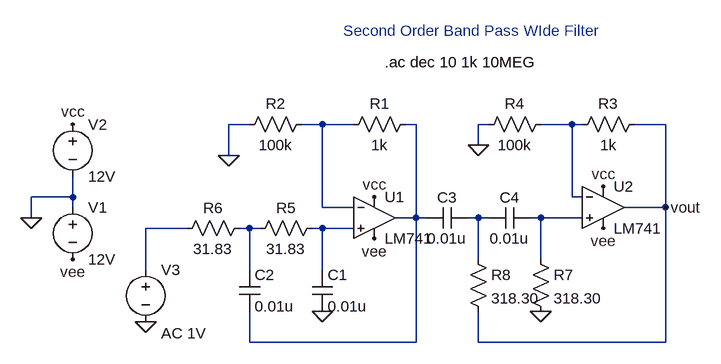
[diagram p0: schematic second_order_band_pass_wide.asc]
second_order_band_pass_wide.asc, the LTspice schematic file:
Version 4.1
SHEET 1 880 680
WIRE 144 32 112 32
WIRE 256 32 224 32
WIRE 304 32 256 32
WIRE 400 32 384 32
WIRE 512 32 496 32
WIRE 640 32 592 32
WIRE 656 32 640 32
WIRE 784 32 736 32
WIRE 496 64 496 32
WIRE 112 80 112 32
WIRE -128 144 -128 112
WIRE -128 144 -192 144
WIRE 640 144 640 32
WIRE 656 144 640 144
WIRE -128 160 -128 144
WIRE 256 160 256 32
WIRE 304 160 256 160
WIRE 784 160 784 32
WIRE 784 160 720 160
WIRE -192 176 -192 144
WIRE 400 176 400 32
WIRE 400 176 368 176
WIRE 416 176 400 176
WIRE 496 176 480 176
WIRE 512 176 496 176
WIRE 592 176 576 176
WIRE 656 176 592 176
WIRE 48 192 -16 192
WIRE 144 192 128 192
WIRE 160 192 144 192
WIRE 256 192 240 192
WIRE 304 192 256 192
WIRE 496 240 496 176
WIRE 592 240 592 176
WIRE -16 256 -16 192
WIRE 144 256 144 192
WIRE 256 256 256 192
WIRE 144 368 144 320
WIRE 400 368 400 176
WIRE 400 368 144 368
WIRE 496 368 496 320
WIRE 784 368 784 160
WIRE 784 368 496 368
FLAG -192 176 0
FLAG 336 144 vcc
FLAG -128 32 vcc
FLAG 688 128 vcc
FLAG 336 208 vee
FLAG 688 192 vee
FLAG -128 240 vee
FLAG 496 64 0
FLAG 112 80 0
FLAG 256 320 0
FLAG 592 320 0
FLAG -16 336 0
FLAG 784 160 vout
SYMBOL voltage -128 144 R0
WINDOW 123 0 0 Left 0
WINDOW 39 0 0 Left 0
SYMATTR InstName V1
SYMATTR Value 12V
SYMBOL voltage -128 16 R0
WINDOW 123 0 0 Left 0
WINDOW 39 0 0 Left 0
SYMATTR InstName V2
SYMATTR Value 12V
SYMBOL LM741 336 112 R0
SYMATTR InstName U1
SYMBOL LM741 688 96 R0
SYMATTR InstName U2
SYMBOL res 400 16 R90
WINDOW 0 0 56 VBottom 2
WINDOW 3 32 56 VTop 2
SYMATTR InstName R1
SYMATTR Value 1k
SYMBOL res 240 16 R90
WINDOW 0 0 56 VBottom 2
WINDOW 3 32 56 VTop 2
SYMATTR InstName R2
SYMATTR Value 100k
SYMBOL res 752 16 R90
WINDOW 0 0 56 VBottom 2
WINDOW 3 32 56 VTop 2
SYMATTR InstName R3
SYMATTR Value 1k
SYMBOL res 608 16 R90
WINDOW 0 0 56 VBottom 2
WINDOW 3 32 56 VTop 2
SYMATTR InstName R4
SYMATTR Value 100k
SYMBOL cap 240 256 R0
SYMATTR InstName C1
SYMATTR Value 0.01u
SYMBOL cap 128 256 R0
SYMATTR InstName C2
SYMATTR Value 0.01u
SYMBOL res 256 176 R90
WINDOW 0 0 56 VBottom 2
WINDOW 3 32 56 VTop 2
SYMATTR InstName R5
SYMATTR Value 31.83
SYMBOL res 144 176 R90
WINDOW 0 0 56 VBottom 2
WINDOW 3 32 56 VTop 2
SYMATTR InstName R6
SYMATTR Value 31.83
SYMBOL cap 480 160 R90
WINDOW 0 0 32 VBottom 2
WINDOW 3 32 32 VTop 2
SYMATTR InstName C3
SYMATTR Value 0.01u
SYMBOL cap 576 160 R90
WINDOW 0 0 32 VBottom 2
WINDOW 3 32 32 VTop 2
SYMATTR InstName C4
SYMATTR Value 0.01u
SYMBOL res 576 224 R0
SYMATTR InstName R7
SYMATTR Value 318.30
SYMBOL res 480 224 R0
SYMATTR InstName R8
SYMATTR Value 318.30
SYMBOL voltage -16 240 R0
WINDOW 123 24 114 Left 2
WINDOW 39 0 0 Left 0
SYMATTR InstName V3
SYMATTR Value ""
SYMATTR Value2 AC 1V
TEXT 288 -112 Left 2 ;Second Order Band Pass WIde Filter
TEXT 352 -64 Left 2 !.ac dec 10 1k 10MEG

The netlist it stands for:
* second_order_band_pass_wide.asc
V1 0 vee 12V
V2 vcc 0 12V
X§U1 N008 N001 vcc vee N002 LM741  ; pins In+ In- V+ V- OUT
X§U2 N005 N003 vcc vee vout LM741  ; pins In+ In- V+ V- OUT
R1 N002 N001 1k
R2 N001 0 100k
R3 vout N003 1k
R4 N003 0 100k
C1 N008 0 0.01u
C2 N007 N002 0.01u
R5 N008 N007 31.83
R6 N007 N006 31.83
C3 N004 N002 0.01u
C4 N005 N004 0.01u
R7 N005 0 318.30
R8 N004 vout 318.30
V3 N006 0 AC 1V
* Second Order Band Pass WIde Filter
.ac dec 10 1k 10MEG
.lib LM741.lib
.backanno
.end